# EAGLE schematic dualAudio2GatewithCV (EAGLE 7.7.0)
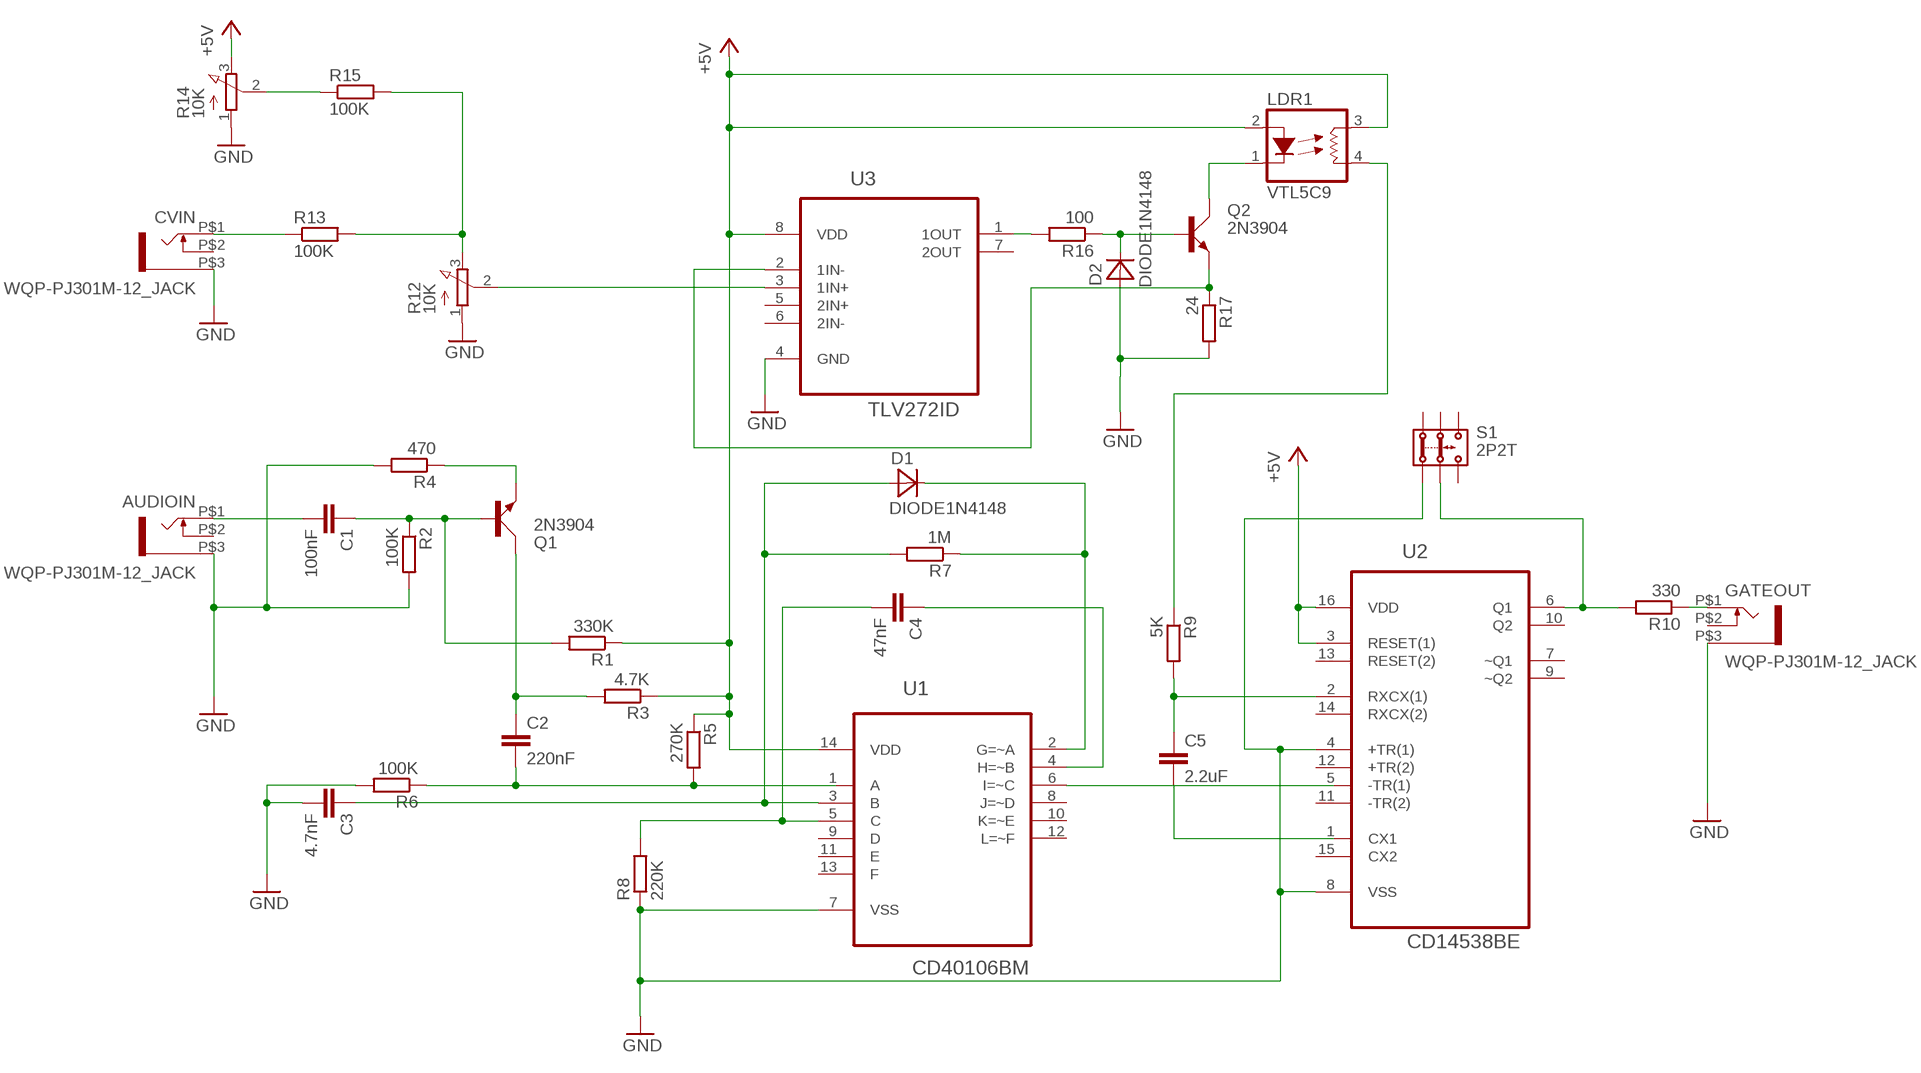
[diagram p0: schematic, sheet 1]

## Parts
AUDIOIN  WQP-PJ301M-12_JACK  [WQP-PJ301M-12_JACK]
C1  100nF  C-EU025-025X050  [C025-025X050]
C2  220nF  C-EU025-025X050  [C025-025X050]
C3  4.7nF  C-EU025-025X050  [C025-025X050]
C4  47nF  C-EU025-025X050  [C025-025X050]
C5  2.2uF  C-EU025-025X050  [C025-025X050]
CVIN  WQP-PJ301M-12_JACK  [WQP-PJ301M-12_JACK]
D1  DIODE1N4148  [DO-35]
D2  DIODE1N4148  [DO-35]
GATEOUT  WQP-PJ301M-12_JACK  [WQP-PJ301M-12_JACK]
LDR1  VTL5C9  [VTL5C]
Q1  2N3904  [TO92D]
Q2  2N3904  [TO92D]
R1  330K  R-EU_0204/2V  [0204V]
R2  100K  R-EU_0204/2V  [0204V]
R3  4.7K  R-EU_0204/2V  [0204V]
R4  470  R-EU_0204/2V  [0204V]
R5  270K  R-EU_0204/2V  [0204V]
R6  100K  R-EU_0204/2V  [0204V]
R7  1M  R-EU_0204/2V  [0204V]
R8  220K  R-EU_0204/2V  [0204V]
R9  5K  R-EU_0204/2V  [0204V]
R10  330  R-EU_0204/2V  [0204V]
R12  10K  3RP/1610N  [3RP/1610N]
R13  100K  R-EU_0204/2V  [0204V]
R14  10K  3RP/1610N  [3RP/1610N]
R15  100K  R-EU_0204/2V  [0204V]
R16  100  R-EU_0204/2V  [0204V]
R17  24  R-EU_0204/2V  [0204V]
S1  2P2T  [2P2T]
U1  CD40106BM  [SOIC127P600X175-14N]
U2  CD14538BE  [DIP254P762X508-16]
U3  TLV272ID  [SOIC127P600X175-8N]

## Nets
+5V: LDR1.2(A) LDR1.3(L1) R1.1 R3.1 R5.1 R14.3(E) U1.14(VDD) U2.3(RESET(1)) U2.16(VDD) U3.8(VDD)
GND: AUDIOIN.P$3 C3.2 CVIN.P$3 D2.+ GATEOUT.P$3 R2.2 R4.2 R6.2 R8.1 R12.1(A) R14.1(A) R17.2 S1.1.2 U1.7(VSS) U2.4(+TR(1)) U2.8(VSS) U3.4(GND)
N$1: C5.1 R9.2 U2.2(RXCX(1))
N$2: U1.6(I=~C) U2.5(-TR(1))
N$3: C5.2 U2.1(CX1)
N$4: C4.1 U1.4(H=~B)
N$5: C4.2 R8.2 U1.5(C)
N$6: C3.1 D1.+ R7.2 U1.3(B)
N$7: D1.- R7.1 U1.2(G=~A)
N$8: C2.2 R5.2 R6.1
N$9: Q1.E R4.1
N$10: AUDIOIN.P$1 C1.2
N$11: C1.1 Q1.B R1.2 R2.1
N$12: C2.1 Q1.C R3.2
N$13: R10.2 S1.2.2 U2.6(Q1)
N$14: GATEOUT.P$1 R10.1
N$15: CVIN.P$1 R13.1
N$17: R12.2(S) U3.3(1IN+)
N$18: R12.3(E) R13.2 R15.2
N$19: R14.2(S) R15.1
N$20: R16.2 U3.1(1OUT)
N$21: D2.- Q2.B R16.1
N$22: LDR1.4(L2) R9.1
N$23: Q2.E R17.1 U3.2(1IN-)
N$24: LDR1.1(C) Q2.C
Unconnected: AUDIOIN.P$2 CVIN.P$2 GATEOUT.P$2 S1.1.1 S1.2.1 S1.3.1 S1.3.2 U1.1(A) U1.8(J=~D) U1.9(D) U1.10(K=~E) U1.11(E) U1.12(L=~F) U1.13(F) U2.7(~Q1) U2.9(~Q2) U2.10(Q2) U2.11(-TR(2)) U2.12(+TR(2)) U2.13(RESET(2)) U2.14(RXCX(2)) U2.15(CX2) U3.5(2IN+) U3.6(2IN-) U3.7(2OUT)

## Library data of the parts
AUDIOIN CVIN GATEOUT = thonkiconn:WQP-PJ301M-12_JACK
C1-C5 = resistorwithpads:C-EU: CAPACITOR, European symbol
D1 D2 = Diodes:DIODE: Diode; SPICE: D{NAME} {+.NET} {-.NET} 1N4148; SPICEMOD: .model 1N4148 D (IS=0.1PA, RS=16 CJO=2PF TT=12N BV=100 IBV=1nA)
LDR1 = optocoupler:VTL5C*: Low Cost Axial Vactrols Source: www.perkinelmer.com/opto ... vtl5c9_c10.pdf; MF: VACTEC PHOTO; MPN: VTL5C9; OC_FARNELL: 2067857; OC_NEWARK: 95F9033
Q1 Q2 = transistor-small-signal:2N3904: NPN TRANSISTOR
R1-R10 R13 R15-R17 = resistorwithpads:R-EU_: RESISTOR, European symbol
R12 R14 = pot:3RP/1610N: 16mm Potentiometer one level Source: http://www.alphapotentiometers.net/html/16mm_pot_2.html
S1 = switch:2P2T: SLIDE SWITCH 2P2T Part No. SS-22F05-G(A)4 Source: CANAL ELECTRONIC CO., LTD .. switsch.pdf
U1 = CD40106BM:CD40106BM: HEX Schimitt Trigger; MPN: CD40106BM; OC_FARNELL: 9589520; OC_NEWARK: 67K2792; PACKAGE: SOIC-14; SUPPLIER: Texas Instruments
U2 = CD14538BE:CD14538BE: CMOS DUAL PRECISION MONOSTABLE MULTIVIBRATOR; MPN: CD14538BE; OC_FARNELL: 1470900; OC_NEWARK: 60K5087; PACKAGE: PDIP-16; SUPPLIER: Texas Instruments
U3 = TLV272:TLV272ID: OPERATONAL AMPLIFIERS; MPN: TLV272ID; OC_FARNELL: 8455279; OC_NEWARK: 38K8448; PACKAGE: SOIC-8; SUPPLIER: TI